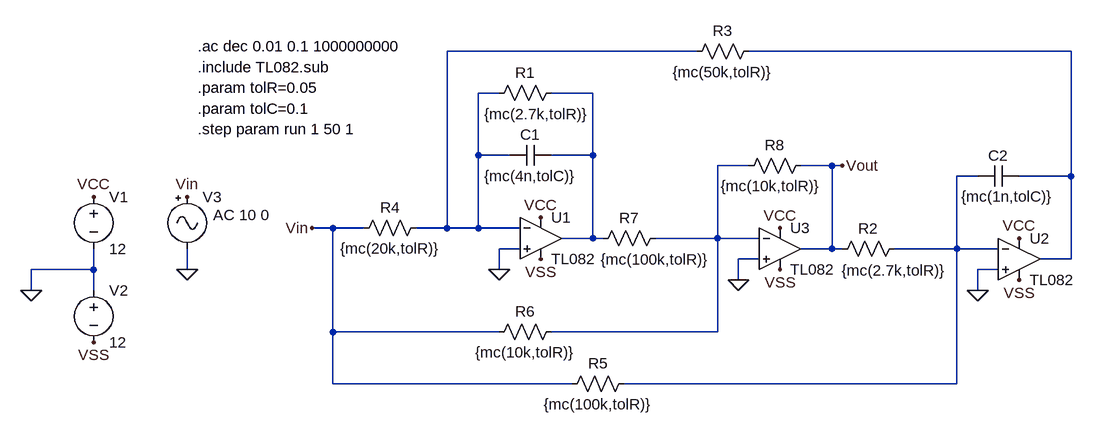
[diagram p0: schematic Filtro.asc]
Filtro.asc, the LTspice schematic file:
Version 4
SHEET 1 880 680
WIRE 80 -144 -304 -144
WIRE 656 -144 160 -144
WIRE -224 -80 -256 -80
WIRE -80 -80 -144 -80
WIRE -256 16 -256 -80
WIRE -208 16 -256 16
WIRE -80 16 -80 -80
WIRE -80 16 -144 16
WIRE 160 32 112 32
WIRE 288 32 240 32
WIRE 304 32 288 32
WIRE 512 48 480 48
WIRE 656 48 656 -144
WIRE 656 48 576 48
WIRE -480 128 -512 128
WIRE -432 128 -480 128
WIRE -304 128 -304 -144
WIRE -304 128 -352 128
WIRE -256 128 -256 16
WIRE -256 128 -304 128
WIRE -192 128 -256 128
WIRE -80 144 -80 16
WIRE -80 144 -128 144
WIRE -64 144 -80 144
WIRE 112 144 112 32
WIRE 112 144 16 144
WIRE 176 144 112 144
WIRE -192 160 -224 160
WIRE 288 160 288 32
WIRE 288 160 240 160
WIRE 304 160 288 160
WIRE 480 160 480 48
WIRE 480 160 384 160
WIRE 544 160 480 160
WIRE 176 176 144 176
WIRE 656 176 656 48
WIRE 656 176 608 176
WIRE -848 192 -848 160
WIRE -848 192 -944 192
WIRE -704 192 -704 160
WIRE -224 192 -224 160
WIRE 544 192 512 192
WIRE 144 208 144 176
WIRE -944 224 -944 192
WIRE -848 224 -848 192
WIRE 512 224 512 192
WIRE -480 288 -480 128
WIRE -224 288 -480 288
WIRE 112 288 112 144
WIRE 112 288 -144 288
WIRE -480 368 -480 288
WIRE -112 368 -480 368
WIRE 480 368 480 160
WIRE 480 368 -32 368
FLAG -944 224 0
FLAG -848 80 VCC
FLAG -848 304 VSS
FLAG -224 192 0
FLAG 144 208 0
FLAG 512 224 0
FLAG -704 192 0
FLAG -704 80 Vin
FLAG -512 128 Vin
FLAG 304 32 Vout
FLAG -160 112 VCC
FLAG 208 128 VCC
FLAG 576 144 VCC
FLAG -160 176 VSS
FLAG 208 192 VSS
FLAG 576 208 VSS
SYMBOL voltage -848 64 R0
WINDOW 123 0 0 Left 2
WINDOW 39 0 0 Left 2
SYMATTR InstName V1
SYMATTR Value 12
SYMBOL voltage -848 208 R0
WINDOW 123 0 0 Left 2
WINDOW 39 0 0 Left 2
SYMATTR InstName V2
SYMATTR Value 12
SYMBOL res -128 -96 R90
WINDOW 0 0 56 VBottom 2
WINDOW 3 33 39 VTop 2
SYMATTR InstName R1
SYMATTR Value {mc(2.7k,tolR)}
SYMBOL res 400 144 R90
WINDOW 0 0 56 VBottom 2
WINDOW 3 34 17 VTop 2
SYMATTR InstName R2
SYMATTR Value {mc(2.7k,tolR)}
SYMBOL res 176 -160 R90
WINDOW 0 0 56 VBottom 2
WINDOW 3 32 56 VTop 2
SYMATTR InstName R3
SYMATTR Value {mc(50k,tolR)}
SYMBOL res -336 112 R90
WINDOW 0 0 56 VBottom 2
WINDOW 3 32 56 VTop 2
SYMATTR InstName R4
SYMATTR Value {mc(20k,tolR)}
SYMBOL res -16 352 R90
WINDOW 0 0 56 VBottom 2
WINDOW 3 32 56 VTop 2
SYMATTR InstName R5
SYMATTR Value {mc(100k,tolR)}
SYMBOL res -128 272 R90
WINDOW 0 0 56 VBottom 2
WINDOW 3 32 56 VTop 2
SYMATTR InstName R6
SYMATTR Value {mc(10k,tolR)}
SYMBOL res 32 128 R90
WINDOW 0 0 56 VBottom 2
WINDOW 3 33 16 VTop 2
SYMATTR InstName R7
SYMATTR Value {mc(100k,tolR)}
SYMBOL res 256 16 R90
WINDOW 0 0 56 VBottom 2
WINDOW 3 32 62 VTop 2
SYMATTR InstName R8
SYMATTR Value {mc(10k,tolR)}
SYMBOL cap -144 0 R90
WINDOW 0 0 32 VBottom 2
WINDOW 3 32 32 VTop 2
SYMATTR InstName C1
SYMATTR Value {mc(4n,tolC)}
SYMBOL cap 576 32 R90
WINDOW 0 0 32 VBottom 2
WINDOW 3 32 18 VTop 2
SYMATTR InstName C2
SYMATTR Value {mc(1n,tolC)}
SYMBOL Misc\\signal -704 64 R0
WINDOW 123 40 44 Left 2
WINDOW 39 0 0 Left 2
SYMATTR Value2 AC 10 0
SYMATTR InstName V3
SYMATTR Value ""
SYMBOL Opamps\\opamp2 -160 80 R0
SYMATTR InstName U1
SYMATTR Value TL082
SYMBOL Opamps\\opamp2 576 112 R0
SYMATTR InstName U2
SYMATTR Value TL082
SYMBOL Opamps\\opamp2 208 96 R0
SYMATTR InstName U3
SYMATTR Value TL082
TEXT -688 -120 Left 2 !.include TL082.sub
TEXT -688 -152 Left 2 !.ac dec 0.01 0.1 1000000000
TEXT -688 -88 Left 2 !.param tolR=0.05
TEXT -688 -56 Left 2 !.param tolC=0.1
TEXT -688 -24 Left 2 !.step param run 1 50 1

The netlist it stands for:
* Filtro.asc
V1 VCC 0 12
V2 0 VSS 12
R1 N003 N001 {mc(2.7k,tolR)}
R2 N005 Vout {mc(2.7k,tolR)}
R3 N002 N001 {mc(50k,tolR)}
R4 N001 Vin {mc(20k,tolR)}
R5 N005 Vin {mc(100k,tolR)}
R6 N004 Vin {mc(10k,tolR)}
R7 N004 N003 {mc(100k,tolR)}
R8 Vout N004 {mc(10k,tolR)}
C1 N003 N001 {mc(4n,tolC)}
C2 N002 N005 {mc(1n,tolC)}
V3 Vin 0 AC 10 0
XU1 0 N001 VCC VSS N003 TL082  ; pins In+ In- V+ V- OUT
XU2 0 N005 VCC VSS N002 TL082  ; pins In+ In- V+ V- OUT
XU3 0 N004 VCC VSS Vout TL082  ; pins In+ In- V+ V- OUT
.include TL082.sub
.ac dec 0.01 0.1 1000000000
.param tolR=0.05
.param tolC=0.1
.step param run 1 50 1
.backanno
.end